# EAGLE design f1control (EAGLE 9.2.0)
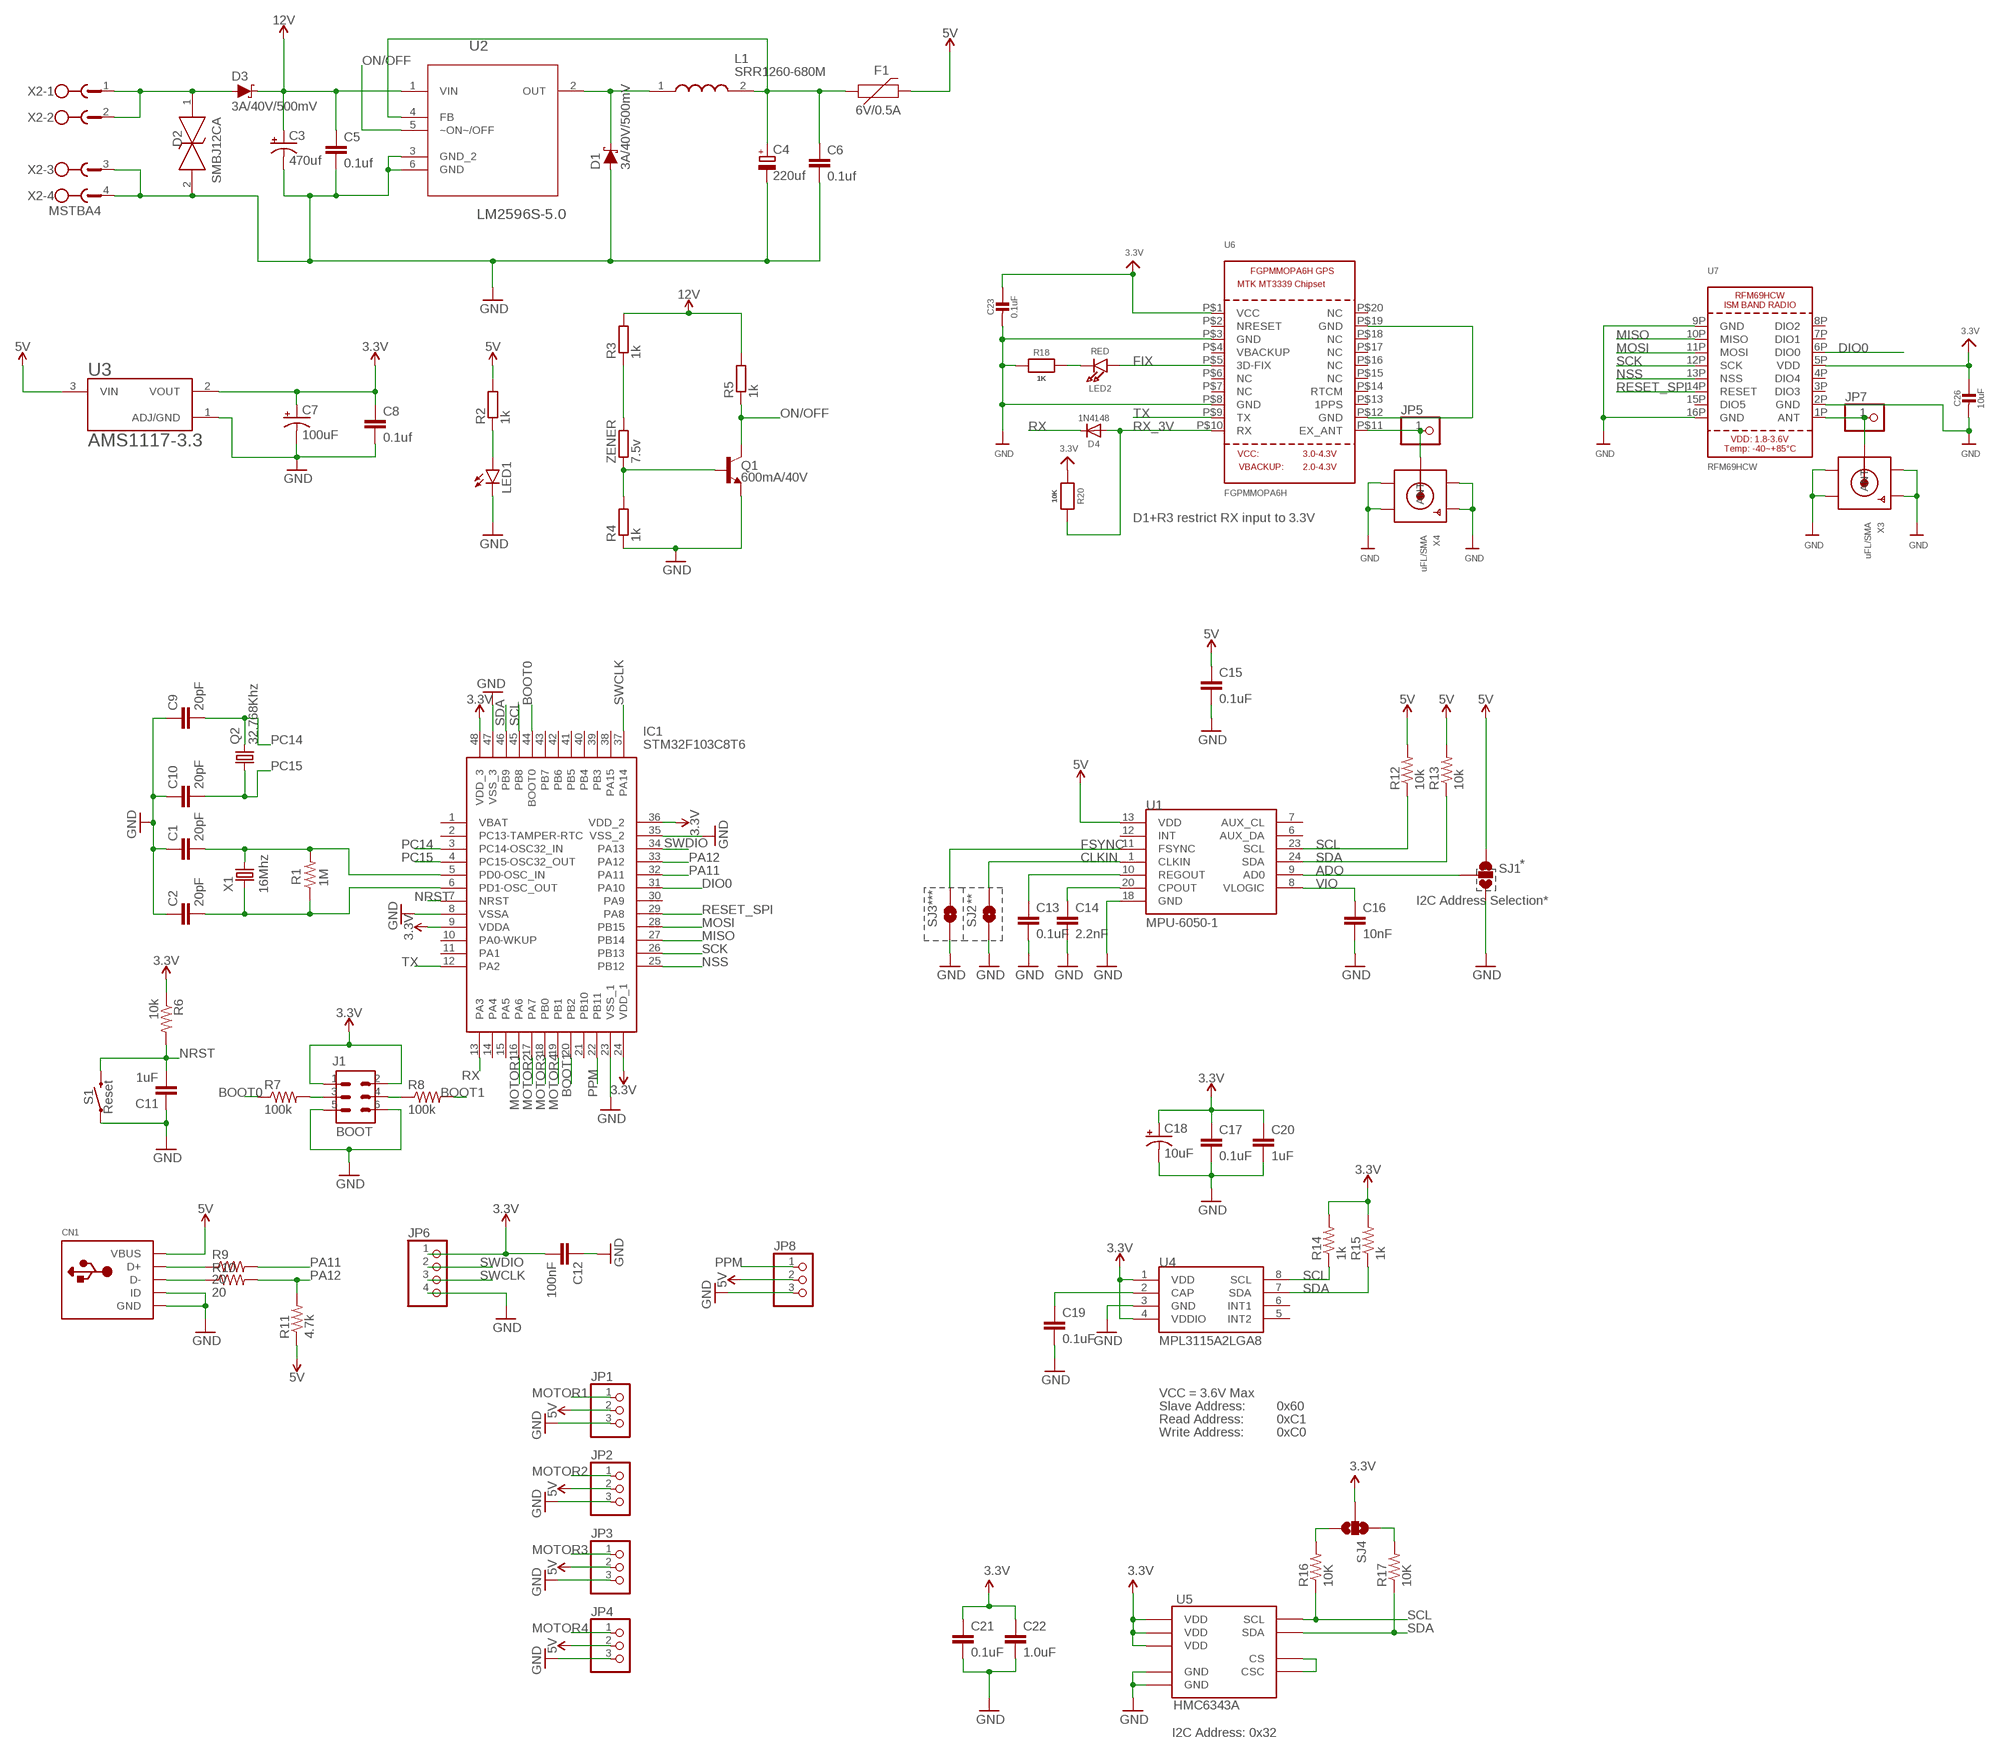
[diagram p0: schematic, sheet 1]

## Parts
C1  20pF  C-EUC0603  [C0603]
C2  20pF  C-EUC0603  [C0603]
C3  470uf  CPOL-USE5-8.5  [E5-8,5]
C4  220uf  CPOL-EU153CLV-1014  [153CLV-1014]
C5  0.1uf  C-EUC0805  [C0805]
C6  0.1uf  C-EUC0805  [C0805]
C7  100uF  100UF-POLAR-10X10.5-63V-20%  [NIC_10X10.5_CAP]
C8  0.1uf  C-EUC0805  [C0805]
C9  20pF  C-EUC0603  [C0603]
C10  20pF  C-EUC0603  [C0603]
C11  1uF  C-EUC0603  [C0603]
C12  100nF  C-EUC0603  [C0603]
C13  0.1uF  CAP0603-CAP  [0603-CAP]
C14  2.2nF  CAP0603-CAP  [0603-CAP]
C15  0.1uF  CAP0603-CAP  [0603-CAP]
C16  10nF  CAP0603-CAP  [0603-CAP]
C17  0.1uF  CAP0402-CAP  [0402-CAP]
C18  10uF  CAP_POL1206  [EIA3216]
C19  0.1uF  CAP0402-CAP  [0402-CAP]
C20  1uF  CAP0402-CAP  [0402-CAP]
C21  0.1uF  0.1UF-25V(+80/-20%)(0603)  [0603-CAP]
C22  1.0uF  1.0UF-16V-10%(0603)  [0603-CAP]
C23  0.1uF  CAP_CERAMIC0805-NOOUTLINE  [0805-NO]
C26  10uF  CAP_CERAMIC0805-NOOUTLINE  [0805-NO]
CN1  USBMINIB  [USB-MINIB]
D1  3A/40V/500mV  DIODE-SCHOTTKY-B340A  [SMA-DIODE]
D2  SMBJ12CA  [DIONM5443X244N]
D3  3A/40V/500mV  DIODE-SCHOTTKY-B340A  [SMA-DIODE]
D4  1N4148  DIODESOD-323  [SOD-323]
F1  6V/0.5A  PPTC_HALF-AMP  [1206]
IC1  STM32F103C8T6  [QFP50P900X900X160-48N]
J1  BOOT  621006245821  [621006245821]
JP1  PINHD-1X3  [1X03]
JP2  PINHD-1X3  [1X03]
JP3  PINHD-1X3  [1X03]
JP4  PINHD-1X3  [1X03]
JP5  HEADER-1X1ROUND  [1X01_ROUND]
JP6  PINHD-1X4  [1X04]
JP7  HEADER-1X1ROUND  [1X01_ROUND]
JP8  PINHD-1X3  [1X03]
L1  SRR1260-680M  [INDPM125125X650N]
LED1  LEDCHIP-LED0805  [CHIP-LED0805]
LED2  RED  LED0805  [CHIPLED_0805]
Q1  600mA/40V  TRANS_NPN-MMBT2222AL  [SOT23-3]
Q2  32.768Khz  MC-306  [MC-306]
R1  1M  R-US_R0603  [R0603]
R2  1k  R-EU_R0805  [R0805]
R3  1k  R-EU_R0805  [R0805]
R4  1k  R-EU_R0805  [R0805]
R5  1k  R-EU_R0805  [R0805]
R6  10k  R-US_R0603  [R0603]
R7  100k  R-US_R0603  [R0603]
R8  100k  R-US_R0603  [R0603]
R9  20  R-US_R0603  [R0603]
R10  20  R-US_R0603  [R0603]
R11  4.7k  R-US_R0603  [R0603]
R12  10k  RESISTOR0603-RES  [0603-RES]
R13  10k  RESISTOR0603-RES  [0603-RES]
R14  1k  RESISTOR0402-RES  [0402-RES]
R15  1k  RESISTOR0402-RES  [0402-RES]
R16  10K  10KOHM1/10W1%(0603)0603  [0603-RES]
R17  10K  10KOHM1/10W1%(0603)0603  [0603-RES]
R18  1K  RESISTOR0805_NOOUTLINE  [0805-NO]
R20  10K  RESISTOR0805_NOOUTLINE  [0805-NO]
S1  Reset  MOMENTARY-SWITCH-SPST-SMD-4.5MM  [TACTILE_SWITCH_SMD_4.5MM]
SJ1  SOLDERJUMPER_2WAYPASTE2&3  [SJ_3_PASTE2&3]
SJ2  SOLDERJUMPERTRACE  [SJ_2S-TRACE]
SJ3  SOLDERJUMPERTRACE  [SJ_2S-TRACE]
SJ4  SOLDERJUMPER_2WAYPASTE1&2&3  [SJ_3_PASTE1&2&3]
U1  MPU-6050-1  [QFN-24-4MM2]
U2  LM2596S-5.0  [TO170P1435X465-6N]
U3  AMS1117-3.3  [SOT229P700X180-4N]
U4  MPL3115A2LGA8  [LGA8]
U5  HMC6343A  [LCC36]
U6  FGPMMOPA6H  GPS_FGPMMOPA6H  [FGPMMOPA6H]
U7  RFM69HCW  RFM69HCW_SMT  [RFMHCW_SMT]
X1  16Mhz  49S/18PF  [XTAL_HC49]
X2  MSTBA4  [MSTBA4]
X3  uFL/SMA  SMACONNECTOR_EDGE_UFL  [SMA_EDGELAUNCH_UFL]
X4  uFL/SMA  SMACONNECTOR_EDGE_UFL  [SMA_EDGELAUNCH_UFL]
ZENER  7.5v  R-EU_0204/7  [0204/7]

## Nets
3.3V: C7.+ C8.1 C12.2 C17.1 C18.A(+) C20.1 C21.1 C22.1 C23.1 C26.1 IC1.9(VDDA) IC1.24(VDD_1) IC1.36(VDD_2) IC1.48(VDD_3) J1.1 J1.2 JP6.1 R6.1 R14.2 R15.2 R20.1 SJ4.2 U3.2(VOUT) U4.1(VDD) U4.4(VDDIO) U5.3(VDD) U5.11(VDD) U5.21(VDD) U6.P$1(VCC) U7.5P(VDD)
5V: C15.1 CN1.VBUS F1.2 JP1.2 JP2.2 JP3.2 JP4.2 JP8.2 R2.2 R11.1 R12.2 R13.2 SJ1.1 U1.13(VDD) U3.3(VIN)
12V: C3.+ C5.1 D3.C R3.2 R5.2 U2.1(VIN)
ADO: SJ1.2 U1.9(AD0)
BOOT0: IC1.44(BOOT0) R7.1
BOOT1: IC1.20(PB2) R8.2
CLKIN: SJ2.2 U1.1(CLKIN)
DIO0: IC1.31(PA10) U7.6P(DIO0)
FIX: LED2.A U6.P$5(3D-FIX)
FSYNC: SJ3.2 U1.11(FSYNC)
GND: C1.1 C2.1 C3.- C4.- C5.2 C6.2 C7.- C8.2 C9.1 C10.1 C11.1 C12.1 C13.2 C14.2 C15.2 C16.2 C17.2 C18.C(-) C19.2 C20.2 C21.2 C22.2 C23.2 C26.2 CN1.GND CN1.ID D1.A D2.2 IC1.8(VSSA) IC1.23(VSS_1) IC1.35(VSS_2) IC1.47(VSS_3) J1.5 J1.6 JP1.3 JP2.3 JP3.3 JP4.3 JP6.4 JP8.3 LED1.C Q1.2(E) R4.1 R18.1 S1.2 S1.3 SJ1.3 SJ2.1 SJ3.1 U1.18(GND) U2.3(GND_2) U2.6(GND) U3.1(ADJ/GND) U4.3(GND) U5.25(GND) U5.29(GND) U6.P$3(GND) U6.P$8(GND) U7.2P(GND) U7.9P(GND) U7.16P(GND) X2.3 X2.4 X3.GND@1(GND1) X3.GND@2(GND2) X3.GND@3(GND3) X3.GND@4(GND4) X4.GND@1(GND1) X4.GND@2(GND2) X4.GND@3(GND3) X4.GND@4(GND4)
MISO: IC1.27(PB14) U7.10P(MISO)
MOSI: IC1.28(PB15) U7.11P(MOSI)
MOTOR1: IC1.16(PA6) JP1.1
MOTOR2: IC1.17(PA7) JP2.1
MOTOR3: IC1.18(PB0) JP3.1
MOTOR4: IC1.19(PB1) JP4.1
N$1: J1.3 R7.2
N$2: C1.2 IC1.5(PD0-OSC_IN) R1.2 X1.2
N$3: C2.2 IC1.6(PD1-OSC_OUT) R1.1 X1.1
N$4: D1.C L1.1 U2.2(OUT)
N$5: LED1.A R2.1
N$6: Q1.1(B) R4.2 ZENER.1
N$7: C4.+ C6.1 F1.1 L1.2 U2.4(FB)
N$8: R3.1 ZENER.2
N$9: D2.1 D3.A X2.1 X2.2
N$10: J1.4 R8.1
N$11: C14.1 U1.20(CPOUT)
N$12: CN1.D+ R9.1
N$13: CN1.D- R10.1
N$14: C13.1 U1.10(REGOUT)
N$15: C19.1 U4.2(CAP)
N$16: U5.22(CS) U5.35(CSC)
N$17: R16.2 SJ4.3
N$18: R17.2 SJ4.1
N$19: LED2.C R18.2
N$20: JP5.1 U6.P$11(EX_ANT) X4.P(ANT)
N$21: JP7.1 U7.1P(ANT) X3.P(ANT)
N$22: U6.P$12(GND) U6.P$19(GND)
NRST: C11.2 IC1.7(NRST) R6.2 S1.1 S1.4
NSS: IC1.25(PB12) U7.13P(NSS)
ON/OFF: Q1.3(C) R5.1 U2.5(~ON~/OFF)
PA11: IC1.32(PA11) R9.2
PA12: IC1.33(PA12) R10.2 R11.2
PC14: C9.2 IC1.3(PC14-OSC32_IN) Q2.4
PC15: C10.2 IC1.4(PC15-OSC32_OUT) Q2.1
PPM: IC1.22(PB11) JP8.1
RESET_SPI: IC1.29(PA8) U7.14P(RESET)
RX: D4.C IC1.13(PA3)
RX_3V: D4.A R20.2 U6.P$10(RX)
SCK: IC1.26(PB13) U7.12P(SCK)
SCL: IC1.45(PB8) R12.1 R14.1 R16.1 U1.23(SCL) U4.8(SCL) U5.32(SCL)
SDA: IC1.46(PB9) R13.1 R15.1 R17.1 U1.24(SDA) U4.7(SDA) U5.36(SDA)
SWCLK: IC1.37(PA14) JP6.3
SWDIO: IC1.34(PA13) JP6.2
TX: IC1.12(PA2) U6.P$9(TX)
VIO: C16.1 U1.8(VLOGIC)
Unconnected: IC1.1(VBAT) IC1.2(PC13-TAMPER-RTC) IC1.10(PA0-WKUP) IC1.11(PA1) IC1.14(PA4) IC1.15(PA5) IC1.21(PB10) IC1.30(PA9) IC1.38(PA15) IC1.39(PB3) IC1.40(PB4) IC1.41(PB5) IC1.42(PB6) IC1.43(PB7) U1.6(AUX_DA) U1.7(AUX_CL) U1.12(INT) U4.5(INT2) U4.6(INT1) U6.P$2(NRESET) U6.P$4(VBACKUP) U6.P$6(NC) U6.P$7(NC) U6.P$13(1PPS) U6.P$14(RTCM) U6.P$15(NC) U6.P$16(NC) U6.P$17(NC) U6.P$18(NC) U6.P$20(NC) U7.3P(DIO3) U7.4P(DIO4) U7.7P(DIO1) U7.8P(DIO2) U7.15P(DIO5)

## Notes on the sheet
- D1+R3 restrict RX input to 3.3V
- *
- *** | ** | I2C Address Selection*
- VCC = 3.6V Max
- Slave Address: | 0x60
- Read Address: | 0xC1
- Write Address: | 0xC0
- I2C Address: 0x32

## Library data of the parts
C1 C2 C5 C6 C8-C12 = rcl:C-EU: CAPACITOR, European symbol; SPICEPREFIX: C
C3 = adafruit:CPOL-US: POLARIZED CAPACITOR, American symbol
C4 = rcl:CPOL-EU: POLARIZED CAPACITOR, European symbol; SPICEPREFIX: C
C7 = SparkFun-Capacitors:100UF-POLAR: 100µF polarized capacitors A capacitor is a passive two-terminal electrical component used to store electrical energy temporarily in an electric field.; PROD_ID: CAP-08362
C13-C17 C19 C20 = SparkFun:CAP: Capacitor Standard 0603 ceramic capacitor, and 0.1" leaded capacitor.
C18 = SparkFun:CAP_POL: Capacitor Polarized These are standard SMD and PTH capacitors. Normally 10uF, 47uF, and 100uF in electrolytic and tantalum varieties. Always verify the external diameter of the through hole cap, it varies with capacity, voltage, and manufacturer. The EIA devices should be standard.
C21 = SparkFun-Capacitors:0.1UF-25V(+80/-20%)(0603): CAP-00810 Ceramic Standard decoupling cap; PROD_ID: CAP-00810
C22 = SparkFun-Capacitors:1.0UF-16V-10%(0603): CAP-00868; PROD_ID: CAP-00868
C23 C26 = microbuilder:CAP_CERAMIC: Ceramic Capacitors For new designs, use the packages preceded by an '_' character since they are more reliable: The following footprints should be used on most boards: _0402 - Standard footprint for regular board layouts _0603 - Standard footprint for regular board layouts _0805 - Standard footprint for regular board layouts _1206 - Standard footprint for regular board layouts For extremely tight-pitch boards where space is at a premium, the following 'micro-pitch' footprints can be used (smaller pads, no silkscreen outline, etc.): _0402MP - Micro-pitch footprint for very dense/compact boards _0603MP - Micro-pitch footprint for very dense/compact boards _0805MP - Micro-pitch footprint for very dense/compact boards _1206MP - Micro-pitch footprint for very dense/compact boards
CN1 = adafruit:USB: USB Connectors USBMINIB - Surface Mount Female Mini-B USB Connector 4UConnector: 06564 By microbuilder.eu Thru-hole RA Female Mini-B USB Connector 4UConnector: 18732 By ladyada.net
D1 D3 = SparkFun-DiscreteSemi:DIODE-SCHOTTKY: Schottky diode A Schottky diode is a semiconductor diode which has a low forward voltage drop and a very fast switching action.; PROD_ID: DIO-09886
D2 = SMBJ12CA:SMBJ12CA: BOURNS - SMBJ12CA - TVS DIODE, 600W, 12V, BIDIR, DO-214AA Source: Datasheet <https://www.mouser.com/ds/2/54/mbj-778392.pdf>; DESCRIPTION: BOURNS - SMBJ12CA - TVS DIODE, 600W, 12V, BIDIR, DO-214AA; HEIGHT: 2.44mm; MANUFACTURER_NAME: Bourns; MANUFACTURER_PART_NUMBER: SMBJ12CA; MOUSER_PART_NUMBER: 652-SMBJ12CA; MOUSER_PRICE-STOCK: https://www.mouser.com/Search/Refine.aspx?Keyword=652-SMBJ12CA
D4 = microbuilder:DIODE: Diode SMA Model Volts Amps Type Vf Ir Digikey # Notes SSA34-E3 40V 3A Schottky 480mV @ 3A 200uA @ 40V SSA34-E3/61TGITR-ND CDBA120-G 20V 1A Schottky 500mV @ 1A 500uA @ 20V 641-1014-6-ND REEL MBRA210 10V 2A Schottky 350mV @ 2A 700uA @ 10V MBRA210LT3 SOD-123 Model Volts Amps Type Vf Ir Order # Notes BAT54T1G 30V 200mA Schottky 800mV @ 200mA 2uA @ 25V BAT54T1GOSTR-ND B0530W 30V 500mA Schottky 430mV @ 500mA 130uA @ 30V B0530W-FDICT-ND REEL MBR120 20V 1A Schottky 340mV @ 1A MBR120VLSFT1GOSCT-ND SOD-323 Model Volts Amps Type Vf Ir Order # Notes PMEG2005EJ 20V 500mA Schottky 355mV @ 500mA 568-4110-1-ND ZLLS410 10V 570mA Schottky 380mV @ 570mA ZLLS410CT-ND 1N4148WS 75V 150mA Silicon/Simple 1V 1N4148WSFSCT-ND REEL SOD-523 Model Volts Amps Type Vf Ir Order # Notes BAT54XV2 30V 200mA Schottky 0.8V @ 100mA BAT54XV2CT-ND TB751S 30V 30mA Schottky RB751S-40TE61CT-ND SOT23-R/W (R = Solder Paste/Reflow Ovens, W = Hand-Soldering) Model Volts Amps Type Vf Ir Order # Notes BAT54FILM 40V 300mA Schottky 497-7162-1-ND POWERDI-5 Model Volts Amps Type Vf Ir Order # Notes PDS560 60V 5A Schottky 670mV @ 5A 150uA @ 60V PDS560DICT-ND
F1 = SparkFun-Fuses:PPTC: Resettable Fuse PPTC Resettable Fuse. Really a sort of resistor with a polymeric positive temperature coefficient whose resistance increases dramatically with an increase in temperature. When heated by the power passing through the resistance rises causing the current to be limited, protecting the circuit. This is achieved by the transition of the polymer from a crystalline to an amorphous state where the conductive carbon separates breaking the conductive pathways found in the cool crystalline structure. When a PPTC cools back down it resumes conducting letting the circuit turn back on. SparkFun Products: SparkFun RedBoard - Programmed with Arduino <https://www.sparkfun.com/products/12757> Pro Micro - 5V/16MHz <https://www.sparkfun.com/products/12640> Arduino Pro 328 - 5V/16MHz <https://www.sparkfun.com/products/10915> MP3 Trigger <https://www.sparkfun.com/products/13720>; PROD_ID: RES-08585
IC1 = STM32F103C8T6:STM32F103C8T6: STM32F103C8T6, 32 bit ARM Cortex M3 Microcontroller 72MHz 64kb Flash, 20kb RAM, USB I2C SPI 48-Pin LQFP Source: Datasheet <http://www.st.com/st-web-ui/static/active/en/resource/technical/document/datasheet/CD00161566.pdf>; ALLIED_NUMBER: 70390993; ALLIED_PRICE-STOCK: http://www.alliedelec.com/stmicroelectronics-stm32f103c8t6/70390993/; DESCRIPTION: STM32F103C8T6, 32 bit ARM Cortex M3 Microcontroller 72MHz 64kb Flash, 20kb RAM, USB I2C SPI 48-Pin LQFP; HEIGHT: 1.6mm; MANUFACTURER_NAME: STMicroelectronics; MANUFACTURER_PART_NUMBER: STM32F103C8T6; MOUSER_PART_NUMBER: 511-STM32F103C8T6; MOUSER_PRICE-STOCK: https://www.mouser.com/Search/Refine.aspx?Keyword=511-STM32F103C8T6; RS_PART_NUMBER: 0402279P; RS_PRICE-STOCK: http://uk.rs-online.com/web/p/products/0402279P
J1 = Headers:621006245821: 2.00mm SMT Straight Dual Low Profile Pin Header WR-PHD Manufacturer's datasheet <https://katalog.we-online.com/em/datasheet/621006245821.pdf>; CREATED_BY: PCBLayout.com; MANUFACTURER: Wurth Elektronik; MPN: 621006245821
JP1-JP4 JP8 = pinhead:PINHD-1X3: PIN HEADER
JP5 JP7 = microbuilder:HEADER-1X1: PIN HEADER
JP6 = pinhead:PINHD-1X4: PIN HEADER
L1 = SRR1260-680M:SRR1260-680M: Power inductor SMD shielded 68uH 2.1A Bourns SRR1260 Series Shielded Wire-wound SMD Inductor with a Ferrite Core, 68 uH +/-20% 2.1A Idc Q:22 Source: Datasheet <https://componentsearchengine.com/Datasheets/2/SRR1260-680M.pdf>; ALLIED_NUMBER: 70277070; ALLIED_PRICE-STOCK: https://www.alliedelec.com/bourns-srr1260-680m/70277070/; DESCRIPTION: Power inductor SMD shielded 68uH 2.1A Bourns SRR1260 Series Shielded Wire-wound SMD Inductor with a Ferrite Core, 68 uH +/-20% 2.1A Idc Q:22; HEIGHT: 6.5mm; MANUFACTURER_NAME: Bourns; MANUFACTURER_PART_NUMBER: SRR1260-680M; MOUSER_PART_NUMBER: 652-SRR1260-680M; MOUSER_PRICE-STOCK: https://www.mouser.com/Search/Refine.aspx?Keyword=652-SRR1260-680M; RS_PART_NUMBER: 7272243P; RS_PRICE-STOCK: http://uk.rs-online.com/web/p/products/7272243P
LED1 = led:LED: LED
LED2 = microbuilder:LED: LED
Q1 = SparkFun-DiscreteSemi:TRANS_NPN: NPN transistor Current controlled devices typically used to amplify current or used as a switch. BC547 - COM-08928 <http://www.sparkfun.com/products/8928> (TO-92 45V 100mA) (1.Collector 2.Base 3.Emitter) 2N3904 - COM-00521 <http://www.sparkfun.com/products/521> (TO-92 40V 200mA) (1.Emitter 2.Base 3.Collector) P2N2222A - COM-12852 <http://www.sparkfun.com/products/12852> (TO-92 40V 600mA) (1.Collector 2.Base 3.Emitter); PROD_ID: TRANS-08049
Q2 = crystal:MC-306: kHz RANGE CRYSTAL UNIT SMD Source: MC-306_405_406_E07X.PDF Homepage <http://www.epsontoyocom.co.jp>; MPN: MC-306 60.0KHZ 100PPM ,12.5PF; OC_FARNELL: 1278040; OC_NEWARK: 31M5576
R1 R6-R11 = adafruit:R-US_: RESISTOR, American symbol
R2-R5 ZENER = rcl:R-EU_: RESISTOR, European symbol; SPICEPREFIX: R
R12-R15 = SparkFun:RESISTOR: Resistor Basic schematic elements and footprints for 0603, 1206, and PTH resistors.
R16 R17 = SparkFun-Resistors:10KOHM1/10W1%(0603): RES-00824; PROD_ID: RES-00824
R18 R20 = microbuilder:RESISTOR: Resistors For new designs, use the packages preceded by an '_' character since they are more reliable: The following footprints should be used on most boards: _0402 - Standard footprint for regular board layouts _0603 - Standard footprint for regular board layouts _0805 - Standard footprint for regular board layouts _1206 - Standard footprint for regular board layouts For extremely tight-pitch boards where space is at a premium, the following 'micro-pitch' footprints can be used (smaller pads, no silkscreen outline, etc.): _0402MP - Micro-pitch footprint for very dense/compact boards _0603MP - Micro-pitch footprint for very dense/compact boards _0805MP - Micro-pitch footprint for very dense/compact boards _1206MP - Micro-pitch footprint for very dense/compact boards
S1 = SparkFun-Switches:MOMENTARY-SWITCH-SPST: Momentary Switch (Pushbutton) - SPST Normally-open (NO) SPST momentary switches (buttons, pushbuttons). Variants PTH-12MM - 12mm square, through-hole Momentary Pushbutton Switch - 12mm Square <https://www.sparkfun.com/products/9190> (COM-09190) PTH-6.0MM, PTH-6.0MM-KIT - 6.0mm square, through-hole Mini Pushbutton Switch <https://www.sparkfun.com/products/97> (COM-00097) KIT package intended for soldering kit's - only one side of pads' copper is exposed. PTH-RIGHT-ANGLE-KIT - Right-angle, through-hole Right Angle Tactile Button <https://www.sparkfun.com/products/10791> - Used on SparkFun BigTime Watch Kit <https://www.sparkfun.com/products/11734> SMD-12MM - 12mm square, surface-mount Tactile Button - SMD (12mm) <https://www.sparkfun.com/products/12993> (COM-12993) Used on SparkFun PicoBoard <https://www.sparkfun.com/products/11888> SMD-4.5MM - 4.5mm Square Trackball Switch Used on SparkFun Blackberry Trackballer Breakout <https://www.sparkfun.com/products/13169> SMD-4.6MMX2.8MM - 4.60mm x 2.80mm, surface mount Used on SparkFun SAMD21 Mini Breakout <https://www.sparkfun.com/products/13664> SMD-5.2MM, SMD-5.2-REDUNDANT - 5.2mm square, surface-mount Mini Pushbutton Switch - SMD <https://www.sparkfun.com/products/8720> (COM-08720) Used on Arduino Pro Mini <https://www.sparkfun.com/products/11114> REDUNDANT package connects both switch circuits together SMD-6.0X3.5MM - 6.0 x 3.5mm, surface mount Momentary Reset Switch SMD <https://www.sparkfun.com/products/8229> (COM-08229) SMD-6.2MM-TALL - 6.2mm square, surface mount Tactile Button - SMD (6mm) <https://www.sparkfun.com/products/12992> Used on SparkFun Digital Sandbox <https://www.sparkfun.com/products/12651> SMD-RIGHT-ANGLE - Right-angle, surface mount Used on SparkFun Block for Intel® Edison - Arduino <https://www.sparkfun.com/products/13036>; PROD_ID: SWCH-09213
SJ1 = SparkFun:SOLDERJUMPER_2WAY: Solder Jumper 2 way solder jumper
SJ2 SJ3 = SparkFun:SOLDERJUMPER: Solder Jumper Standard SMD solder jumper. Used to automate production. Two varients : Normally Open and Normally Closed are the same, but have different paste layers. NC will have a large amount of paste and should jumper during reflow.
SJ4 = SparkFun-Passives:SOLDERJUMPER_2WAY: Solder Jumper 2 way solder jumper
U1 = Testing:MPU-6050
U2 = LM2596S-5.0:LM2596S-5.0: Step-Down Voltage Regulator; AVAILABILITY: Unavailable; MF: Texas; MP: LM2596S-5.0; PACKAGE: TO-263-6 NEC; PRICE: None
U3 = AMS1117-3.3:AMS1117-3.3: Sot223/Pkg 1-Amp 3.3-Volt Low Drop Out Voltage Regulatator; AVAILABILITY: Unavailable; DESCRIPTION: Sot223/Pkg 1-Amp 3.3-Volt Low Drop Out Voltage Regulatator; MF: Advanced Monolithic Systems; MP: AMS1117-3.3; PACKAGE: None; PRICE: None
U4 = SparkFun-Sensors:MPL3115A2: Altimeter/Pressure Sensor, I2C, 1.95V-3.6V supply, 50 to 110kPa
U5 = SparkFun-Sensors:HMC6343: Honeywell compass IC with tilt compensation, SEN-08656
U6 = microbuilder:GPS_FGPMMOPA6H: GPS Module - MTK MT3339 Chipset, -165dBm sensitivity, 22 channels, 10Hz, auto-select external antenna options
U7 = microbuilder:RFM69HCW: RFM69HCW - ISM Band RF Transceiver
X1 = Crystals:49S/18PF: Crystal Manufacturer's datasheet <https://datasheet.octopart.com/49S-18PF-Xinhunjing-datasheet-30677139.pdf>; CREATED_BY: PCBLayout.com; MANUFACTURER: Xinhunjing; MPN: 49S/18PF; PACKAGE: SMD
X2 = con-phoenix-508:MSTBA4: PHOENIX; MF: FARNELL; MPN: 1757268; OC_FARNELL: 3705195; OC_NEWARK: 71C4163
X3 X4 = microbuilder:SMACONNECTOR: SMA Connector 90° DIP SMA Connector, 50 Ohm (4UConnector: 07259)

## Board
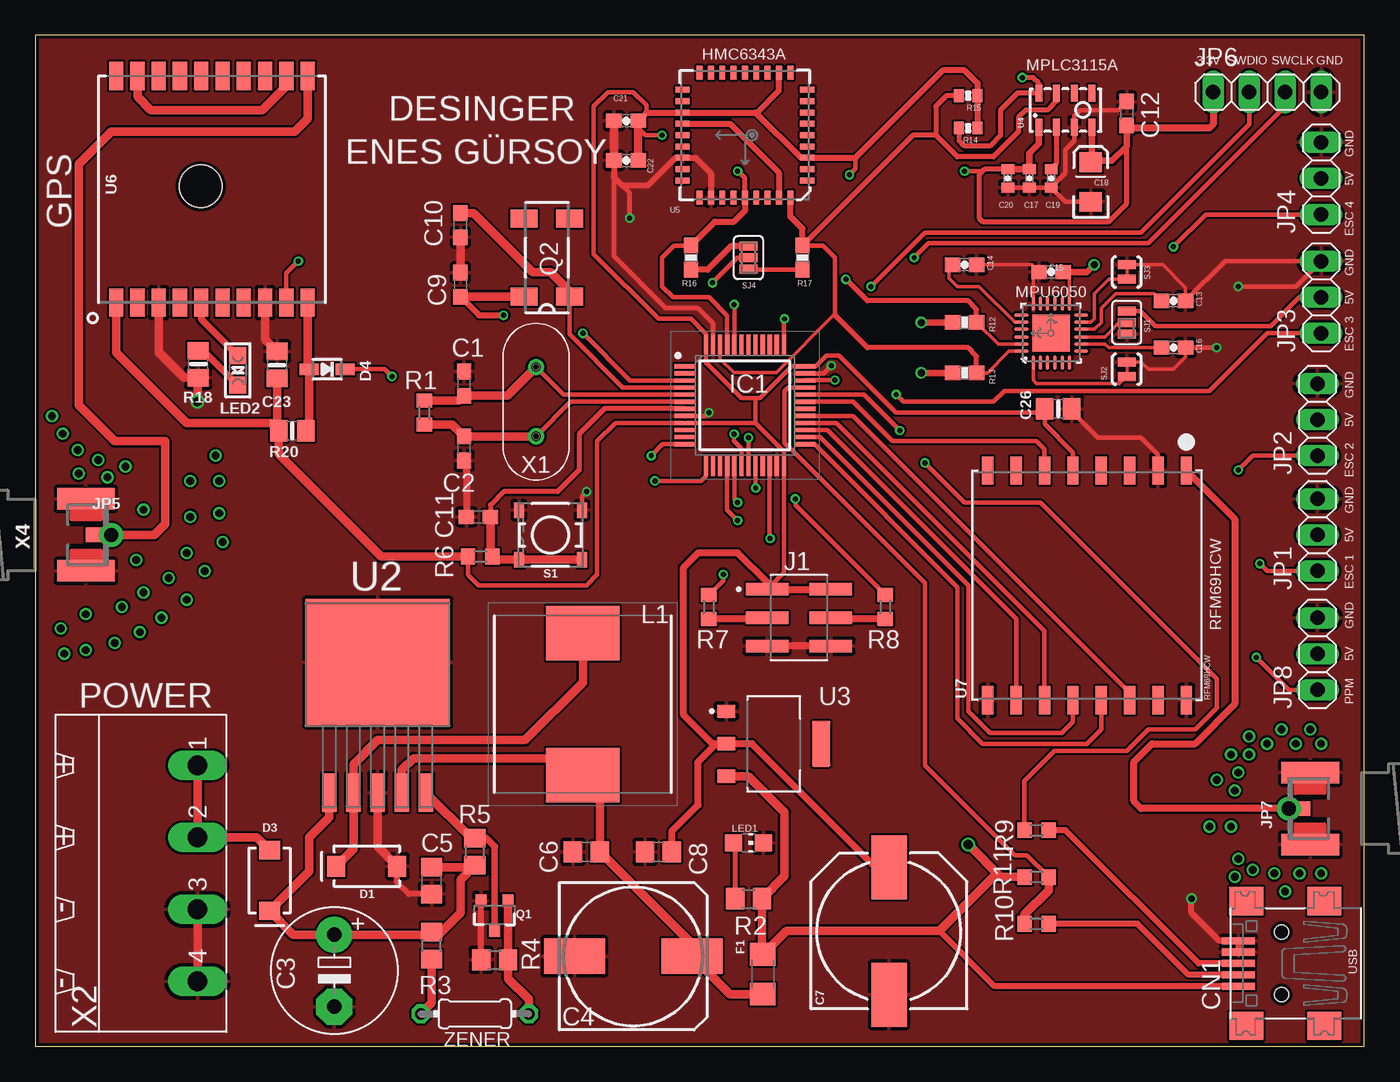
[diagram p1: board, top side]
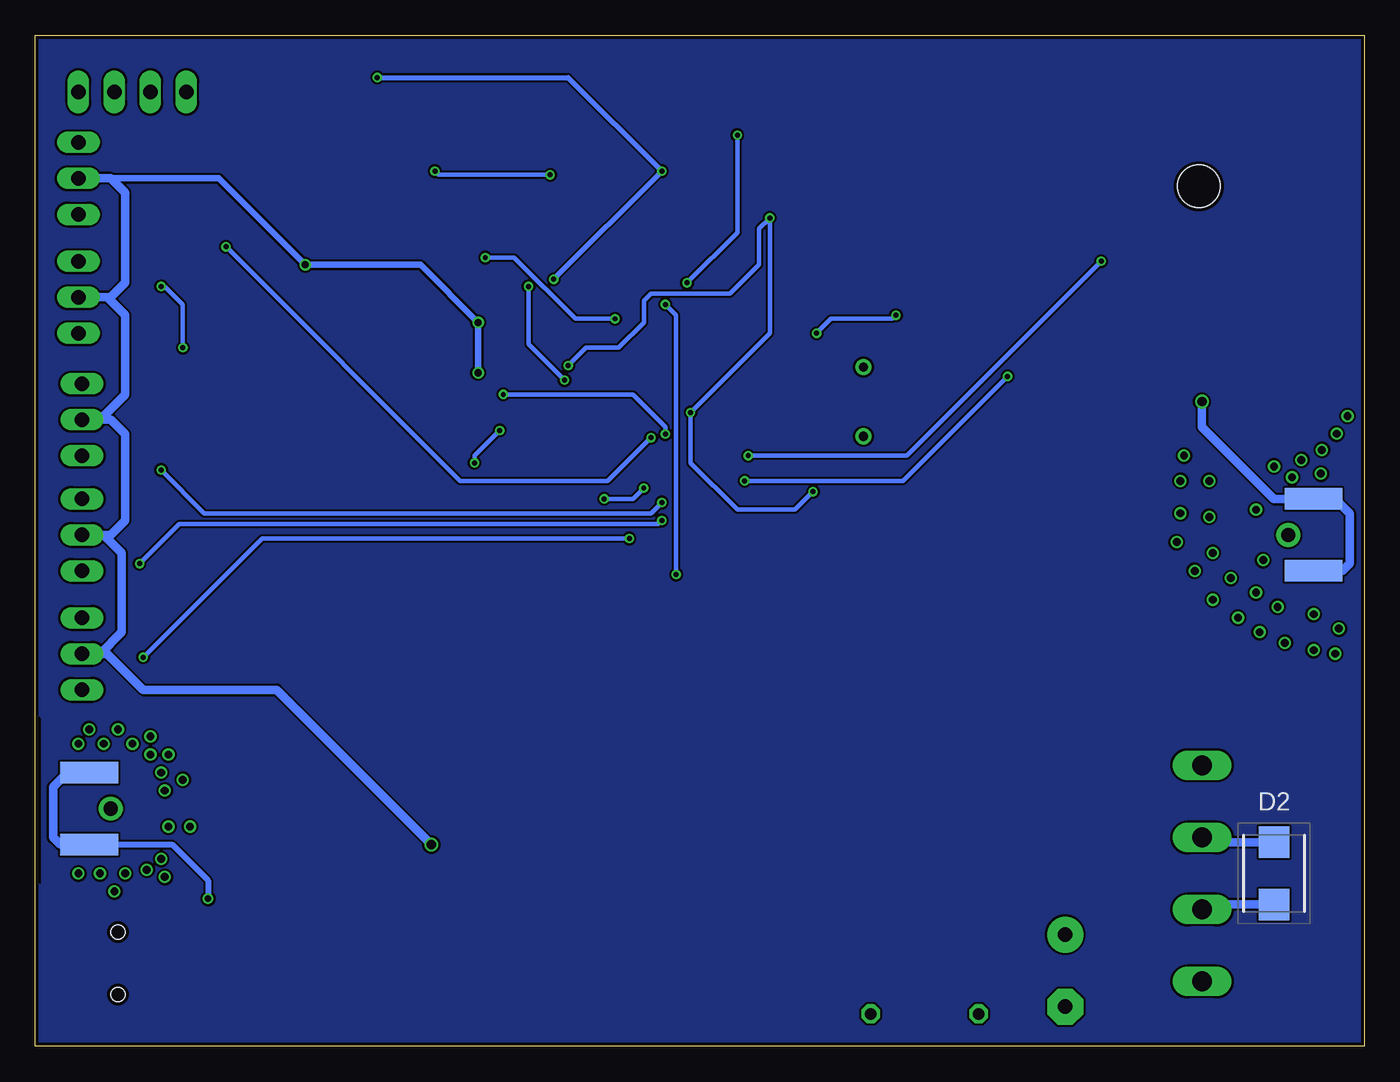
[diagram p2: board, bottom side, seen from below]

Size 93.71 x 71.3 mm. Coordinates in mm from the lower left corner, seen from the top.
Outline: 0,0 93.71,0 93.71,71.3 0,71.3 0,0
Copper layers (1*16): Top 0.035mm / dielectric 1.5mm / Bottom 0.035mm
Design rules "SeeedStudio_2layer_DRU_no_angle_20140221": minimum track width 6mil, minimum drill 12mil, track to track 6mil, track to pad 6mil, pad to pad 6mil, via to via 6mil, smd to smd 0mil, copper to edge 10mil, drill to drill 10mil, minimum pad ring 10mil, minimum via ring 6mil, stop-mask expansion 2mil, vias tented up to drill 100mil, thermal gap 10mil

### Footprints (pad centres in the part's own frame; a part is rotated, then mirrored left to right if it is on the bottom)
C0603 = smd 1.1 x 1: 1 -0.85,0; 2 0.85,0
E5-8,5 = drill 1.016 pad 2.54: + -2.54,0 | drill 1.016 pad 2.54 octagon: - 2.54,0
153CLV-1014 = smd 4.3 x 2.5: + 4.15,0; - -4.15,0
C0805 = smd 1.3 x 1.5: 1 -0.95,0; 2 0.95,0
NIC_10X10.5_CAP = smd 4.5 x 2.5: + 4.5,0; - -4.5,0
0603-CAP = smd 1.1 x 1: 1 -0.85,0; 2 0.85,0
0402-CAP = smd 0.7 x 0.9: 1 -0.65,0; 2 0.65,0
EIA3216 = smd 1.4 x 1.6: A 1.4,0; C -1.4,0
0805-NO = smd 1.24 x 1.5: 1 -0.95,0; 2 0.95,0
USB-MINIB = smd 0.5 x 2.308: D+ 0,4.064; D- -0.8,4.064; GND 1.6,4.064; ID 0.8,4.064; VBUS -1.6,4.064 | smd 2 x 2.4: GND1 -4.4,-2; GND2 -4.4,3.5; GND3 4.4,3.5; GND4 4.4,-2 | hole 1: -2.2,1; 2.2,1
SMA-DIODE = smd 1.27 x 1.47: A -2.15,0; C 2.15,0
DIONM5443X244N = smd 2.2 x 2.15: 1 -2.2,0; 2 2.2,0
SOD-323 = smd 1.35 x 0.8: A 1.27,0; C -1.27,0
1206 = smd 1.6 x 1.8: 1 -1.4,0; 2 1.4,0
QFP50P900X900X160-48N = smd 1.475 x 0.3: 1 -4.238,2.75; 2 -4.238,2.25; 3 -4.238,1.75; 4 -4.238,1.25; 5 -4.238,0.75; 6 -4.238,0.25; 7 -4.238,-0.25; 8 -4.238,-0.75; 9 -4.238,-1.25; 10 -4.238,-1.75; 11 -4.238,-2.25; 12 -4.238,-2.75; 25 4.238,-2.75; 26 4.238,-2.25; 27 4.238,-1.75; 28 4.238,-1.25; 29 4.238,-0.75; 30 4.238,-0.25; 31 4.238,0.25; 32 4.238,0.75; 33 4.238,1.25; 34 4.238,1.75; 35 4.238,2.25; 36 4.238,2.75 | smd 0.3 x 1.475: 13 -2.75,-4.238; 14 -2.25,-4.238; 15 -1.75,-4.238; 16 -1.25,-4.238; 17 -0.75,-4.238; 18 -0.25,-4.238; 19 0.25,-4.238; 20 0.75,-4.238; 21 1.25,-4.238; 22 1.75,-4.238; 23 2.25,-4.238; 24 2.75,-4.238; 37 2.75,4.238; 38 2.25,4.238; 39 1.75,4.238; 40 1.25,4.238; 41 0.75,4.238; 42 0.25,4.238; 43 -0.25,4.238; 44 -0.75,4.238; 45 -1.25,4.238; 46 -1.75,4.238; 47 -2.25,4.238; 48 -2.75,4.238
621006245821 = smd 0.89 x 3: 1 -2,-2.25; 2 -2,2.25; 3 0,-2.25; 4 0,2.25; 5 2,-2.25; 6 2,2.25
1X03 = drill 1.016 long: 1 -2.54,0; 2 0,0; 3 2.54,0
1X01_ROUND = drill 1 pad 1.676: 1 0,0
1X04 = drill 1.016 long: 1 -3.81,0; 2 -1.27,0; 3 1.27,0; 4 3.81,0
INDPM125125X650N = smd 3.85 x 5.2: 1 -5,0; 2 5,0
CHIP-LED0805 = smd 1.2 x 1.2: A 0,-1.05; C 0,1.05
CHIPLED_0805 = smd 1.2 x 1.2: A 0,-1.05; C 0,1.05
SOT23-3 = smd 0.8 x 0.9: 1 -0.95,-1; 2 0.95,-1; 3 0,1.1
MC-306 = smd 1.3 x 1.9: 1 -2.75,-1.6; 2 2.75,-1.6; 3 2.75,1.6; 4 -2.75,1.6
R0603 = smd 1 x 1.1: 1 -0.85,0; 2 0.85,0
R0805 = smd 1.3 x 1.5: 1 -0.95,0; 2 0.95,0
0603-RES = smd 1.1 x 1: 1 -0.85,0; 2 0.85,0
0402-RES = smd 0.7 x 0.9: 1 -0.65,0; 2 0.65,0
TACTILE_SWITCH_SMD_4.5MM = smd 0.7 x 1.1: 1 2.225,1.75; 2 2.225,-1.75; 3 -2.225,-1.75; 4 -2.225,1.75
SJ_3_PASTE2&3 = smd 0.635 x 1.27: 1 -0.813,0; 2 0,0; 3 0.813,0
SJ_2S-TRACE = smd 0.635 x 1.27: 1 -0.508,0; 2 0.508,0
SJ_3_PASTE1&2&3 = smd 0.635 x 1.27: 1 -0.813,0; 2 0,0; 3 0.813,0
QFN-24-4MM2 = smd 1.016 x 0.254: 1 -2.066,1.257; 2 -2.066,0.75; 3 -2.066,0.247; 4 -2.066,-0.287; 5 -2.066,-0.792; 6 -2.066,-1.297; 13 2.086,-1.297; 14 2.086,-0.792; 15 2.086,-0.287; 16 2.086,0.247; 17 2.086,0.75; 18 2.086,1.257 | smd 0.254 x 1.016: 7 -1.267,-2.122; 8 -0.762,-2.122; 9 -0.258,-2.122; 10 0.278,-2.122; 11 0.78,-2.122; 12 1.287,-2.122; 19 1.287,2.082; 20 0.78,2.082; 21 0.278,2.082; 22 -0.258,2.082; 23 -0.762,2.082; 24 -1.267,2.082 | smd 2.616 x 2.616: P$1 0.02,-0.01
TO170P1435X465-6N = smd 1.016 x 2.692: 1 -3.404,-9.042; 2 -1.702,-9.042; 3 0,-9.042; 4 1.702,-9.042; 5 3.404,-9.042 | smd 10.16 x 8.941: 6 0,0.152
SOT229P700X180-4N = smd 0.93 x 1.31: 1 -2.29,-3.345; 2 0,-3.345; 3 2.29,-3.345 | smd 3.24 x 1.31: 4 0,3.345
LGA8 = smd 1.2 x 0.5: 1 -1.2,1.875; 2 -1.2,0.625; 3 -1.2,-0.625; 4 -1.2,-1.875; 5 1.2,-1.875; 6 1.2,-0.625; 7 1.2,0.625; 8 1.2,1.875
LCC36 = smd 1 x 0.42: 1 -4.4,3.2; 2 -4.4,2.4; 3 -4.4,1.6; 4 -4.4,0.8; 5 -4.4,0; 6 -4.4,-0.8; 7 -4.4,-1.6; 8 -4.4,-2.4; 9 -4.4,-3.2; 19 4.4,-3.2; 20 4.4,-2.4; 21 4.4,-1.6; 22 4.4,-0.8; 23 4.4,0; 24 4.4,0.8; 25 4.4,1.6; 26 4.4,2.4; 27 4.4,3.2 | smd 0.42 x 1: 10 -3.2,-4.4; 11 -2.4,-4.4; 12 -1.6,-4.4; 13 -0.8,-4.4; 14 0,-4.4; 15 0.8,-4.4; 16 1.6,-4.4; 17 2.4,-4.4; 18 3.2,-4.4; 28 3.2,4.4; 29 2.4,4.4; 30 1.6,4.4; 31 0.8,4.4; 32 0,4.4; 33 -0.8,4.4; 34 -1.6,4.4; 35 -2.4,4.4; 36 -3.2,4.4
FGPMMOPA6H = smd 2 x 1: P$1 -8,6.75; P$2 -8,5.25; P$3 -8,3.75; P$4 -8,2.25; P$5 -8,0.75; P$6 -8,-0.75; P$7 -8,-2.25; P$8 -8,-3.75; P$9 -8,-5.25; P$10 -8,-6.75; P$11 8,-6.75; P$12 8,-5.25; P$13 8,-3.75; P$14 8,-2.25; P$15 8,-0.75; P$16 8,0.75; P$17 8,2.25; P$18 8,3.75; P$19 8,5.25; P$20 8,6.75 | hole 3: 0.2,0.8
RFMHCW_SMT = smd 2 x 0.8: 1P 8.1,-7; 2P 8.1,-5; 3P 8.1,-3; 4P 8.1,-1; 5P 8.1,1; 6P 8.1,3; 7P 8.1,5; 8P 8.1,7; 9P -8.1,7; 10P -8.1,5; 11P -8.1,3; 12P -8.1,1; 13P -8.1,-1; 14P -8.1,-3; 15P -8.1,-5; 16P -8.1,-7
XTAL_HC49 = drill 0.65 pad 1.05: 1 -2.44,0; 2 2.44,0
MSTBA4 = drill 1.397 long: 1 -7.62,5.08; 2 -2.54,5.08; 3 2.54,5.08; 4 7.62,5.08
SMA_EDGELAUNCH_UFL = smd 4.064 x 1.524: GND@1 2.032,-2.54; GND@2 2.032,2.54 | smd 4.064 x 1.524 bottom: GND@3 2.032,2.54; GND@4 2.032,-2.54 | smd 2.032 x 1.016: P 3.048,0
0204/7 = drill 0.813 octagon: 1 -3.81,0; 2 3.81,0

### Placement (x,y rotation side)
C1  30.23,46.74 270 top
C2  30.23,42.16 90 top
C3  21.08,5.33 270 top
C4  42.16,6.35 0 top
C5  27.94,11.68 270 top
C6  38.86,13.72 180 top
C7  60.2,8.13 90 top
C8  43.94,13.72 180 top
C9  29.97,53.72 270 top
C10  29.97,57.91 90 top
C11  31.24,37.34 0 top
C12  76.96,65.79 270 top
C13  80.26,52.58 0 top
C14  65.53,55.12 0 top
C15  71.63,54.61 180 top
C16  80.26,49.28 0 top
C17  70.1,61.21 270 top
C18  74.42,60.96 90 top
C19  71.63,61.21 270 top
C20  68.58,61.21 270 top
C21  41.66,65.28 180 top
C22  41.66,62.48 180 top
C23  17.04,48.06 90 top
C26  72.14,44.96 0 top
CN1  88.9,5.84 90 top
D1  23.37,12.7 180 top
D2  6.35,12.19 270 bottom
D3  16.51,11.68 270 top
D4  20.57,47.75 180 top
F1  51.31,5.08 90 top
IC1  50.04,45.21 0 top
J1  53.85,30.23 270 top
JP1  90.42,36.07 90 top
JP2  90.42,44.2 90 top
JP3  90.68,52.83 90 top
JP4  90.68,61.21 90 top
JP5  5.33,36.07 0 top
JP6  86.87,67.31 0 top
JP7  88.39,16.76 270 top
JP8  90.42,27.69 90 top
L1  38.61,24.13 270 top
LED1  50.29,14.35 270 top
LED2  14.27,47.68 180 top
Q1  32.38,9.27 180 top
Q2  36.07,55.63 90 top
R1  27.43,44.7 90 top
R2  50.29,10.41 0 top
R3  27.94,7.11 90 top
R4  32.38,6.1 0 top
R5  30.99,13.72 270 top
R6  31.37,34.54 0 top
R7  47.5,30.99 270 top
R8  59.94,30.99 90 top
R9  70.61,15.24 180 top
R10  70.61,8.64 180 top
R11  70.61,11.94 0 top
R12  65.53,51.05 180 top
R13  65.53,47.5 180 top
R14  65.79,64.77 0 top
R15  65.79,67.06 0 top
R16  46.23,55.63 270 top
R17  54.1,55.63 270 top
R18  11.48,48.11 90 top
R20  18.11,43.41 0 top
S1  36.32,36.07 180 top
SJ1  76.96,51.05 270 top
SJ2  76.96,47.75 270 top
SJ3  76.96,54.61 270 top
SJ4  50.29,55.63 90 top
U1  71.63,50.29 90 top
U2  24.13,26.92 0 top
U3  52.07,21.34 270 top
U4  72.64,66.04 90 top
U5  50.04,64.26 180 top
U6  12.45,60.45 90 top
U7  74.17,32.51 90 top
X1  35.31,45.47 90 top
X2  6.35,12.19 270 top
X3  91.95,16.76 180 top
X4  1.52,36.07 0 top
ZENER  30.99,2.29 180 top

### Tracks (layer width: path | path; a pad name or v marks a point on that pad's centre or on a via)
3.3V  (via drill 0.35)
  Top 0.305: U7.5P 73.17,41.89 71.19,43.88 71.19,44.7 | 71.19,44.7 C26.1 | J1.1 52.79,33.42 IC1.24 52.79,41.95 50.78,43.96 | 50.78,43.96 IC1.9 40.92,43.97 39.62,42.67 39.62,33.27 38.86,32.51 31.24,32.51 30.52,33.23 R6.1 | 50.78,45.72 50.78,43.96 | 50.78,45.72 49.78,45.72 47.29,48.22 IC1.48 47.29,50.25 46.23,51.31 43.94,51.31 39.37,55.88 39.37,66.29 40.39,67.31 42.16,67.31 43.09,66.38 43.09,65.86 | 50.78,45.72 51.11,45.72 53.35,47.96 IC1.36 55.04,47.96 55.8,48.72 56.69,48.72 60.71,44.7 71.19,44.7 | SJ4.2 49.53,55.63 v47.75,53.85 | v44.2,64.26 43.01,64.26 42.51,64.77 | 57.84,62.66 57.84,61.9 v57.4,61.47 | v65.53,61.72 66.8,61.72 66.94,61.86
  Top 0.356: C20.1 66.94,61.86 66.55,61.47 66.55,58.42 66.8,58.17 75.69,58.17 76.96,59.44 76.96,63.5
  Top 0.406: C21.1 43.09,65.86 U5.21 50.8,65.86 | 50.8,65.86 50.88,65.86 52.44,67.42 U5.11 | 50.8,65.86 54,62.66 U5.3 57.84,62.66 64.01,68.83 65.53,68.83 66.44,67.93 R15.2 R14.2
  Top 0.457: U4.1 70.77,63.66 70.1,62.99 C17.1 C20.1 | U4.4 74.52,62.46 | 74.52,62.46 C18.A | C12.2 76.96,64.77 76.96,63.5 75.92,62.46 74.52,62.46
  Top 0.508: C7.+ 59.25,12.63 50.55,21.34 U3.2 | C8.1 44.89,15.17 46.74,17.02 46.74,20.07 48.01,21.34 U3.2 | J1.2 J1.1 51.6,32.73 49.53,34.8 46.74,34.8 45.72,33.78 45.72,23.37 47.75,21.34 U3.2 | JP6.1 83.06,65.02 82.8,64.77 76.96,64.77
  Top 0.61: U6.P$1 5.7,48.91 10.67,43.94 16.63,43.94 R20.1 | C23.1 17.04,43.52 R20.1 | R6.1 24.38,34.54 17.16,41.77 R20.1 | C21.1 42.51,64.77 C22.1
  Bottom 0.305: v47.75,53.85 44.2,57.4 v44.2,64.26 | v57.4,61.47 65.28,61.47 v65.53,61.72
5V  (via drill 0.5, 0.65)
  Top 0.254: U1.13 72.92,54.16 C15.1
  Top 0.305: SJ1.1 77.93,51.87 78.99,50.8 87.12,50.8 89.15,52.83 JP3.2
  Top 0.406: CN1.VBUS 67.64,4.24 63.75,8.13
  Top 0.457: v74.68,55.12 74.17,54.61 C15.1 | R12.2 v62.48,51.05 | R13.2 v62.48,47.5
  Top 0.61: U3.3 50.3,19.05 52.83,16.51 52.83,12 R2.2 51.24,6.55 F1.2 52.96,8.13 63.75,8.13 67.56,11.94 68.07,11.94 | R11.1 68.07,11.94 | 68.07,11.94 v65.79,14.22
  Bottom 0.457: JP4.2 80.77,61.21 v74.68,55.12 66.55,55.12 v62.48,51.05 v62.48,47.5
  Bottom 0.61: v65.79,14.22 76.71,25.15 86.11,25.15 88.65,27.69 JP8.2 89.15,27.69 87.63,29.21 87.63,34.8 88.9,36.07 JP1.2 88.39,36.07 87.38,37.08 87.38,43.18 88.39,44.2 JP2.2 89.15,44.2 87.38,45.97 87.38,51.56 88.65,52.83 JP3.2 88.39,52.83 87.38,53.85 87.38,60.2 88.39,61.21 JP4.2
12V
  Top 0.61: 27.75,7.87 C3.+ 18.17,7.87 D3.C 19.3,12.33 19.3,14.73 20.73,16.15 U2.1 | 27.75,7.87 R3.2 | C5.1 30.86,12.63 R5.2 29.97,11.75 29.97,9.4 28.45,7.87 27.75,7.87
ADO
  Top 0.254: SJ1.2 76.43,51.05 76.05,50.67 76.05,50.65 75.43,50.03 U1.9
BOOT0  (via drill 0.35)
  Top 0.305: R7.1 48.51,32.85 v48.51,33.27 | IC1.44 49.29,52.31 v49.28,52.32
  Bottom 0.305: v48.51,33.27 48.51,51.56 v49.28,52.32
BOOT1  (via drill 0.35)
  Top 0.305: R8.2 53.59,38.19 v53.59,38.61 | IC1.20 50.8,40.96 v50.8,39.37
  Bottom 0.305: v53.59,38.61 51.56,38.61 v50.8,39.37
CLKIN
  Top 0.254: U1.1 70.37,46.98 70.61,46.74 76.45,46.74 SJ2.2
DIO0
  Top 0.305: U7.6P 71.17,42.12 70.61,42.67 60.45,42.67 57.66,45.47 IC1.31
FIX
  Top 0.508: U6.P$5 11.7,51.3 LED2.A
FSYNC
  Top 0.254: U1.11 74.44,51.07 74.68,51.31 74.68,53.09 75.69,54.1 SJ3.2
GND  (via drill 0.35, 0.45, 0.65)
  Top 0.254: U1.18 70.37,54.2 C15.2 70.27,55.12 C14.2 | C16.2 81.11,48.6 80.26,47.75 78.49,47.75 77.98,48.26 SJ2.1 | C13.2 81.11,53.51 79.5,55.12 SJ3.1
  Top 0.305: U7.2P 79.17,41.74 77.98,42.93 74.93,42.93 73.09,44.77 C26.2 | C19.2 C17.2 C20.2 | C19.2 72.63,59.56 C18.C | C19.2 72.64,61.58 72.64,63.25 73.27,63.87 U4.3 73.27,65.65 73.66,66.04 76.37,66.04 C12.1 | IC1.8 47.26,44.46 v47.5,44.7 | v38.86,39.12 38.55,38.8 S1.3 | IC1.47 47.79,51.02 46.74,52.07 44.45,52.07 40.81,55.71 40.81,61.3 41.91,60.2 v41.91,58.42 | IC1.35 55.59,47.46 v56.13,48.01 | C13.2 83.91,55.37 JP3.3 88.9,53.59 v84.84,53.59 | C16.2 v83.31,49.28 | 89.92,14.57 X3.GND@3 | X3.GND@4 89.92,18.96
  Top 0.406: R4.1 Q1.2 | C5.2 26.35,10.73 25.52,11.57 D1.A | C22.2 40.81,61.3 41.4,60.71 43.18,60.71 45.14,62.66 U5.25 46.56,62.66 47.64,61.58 U5.29 | CN1.ID CN1.GND 83.49,7.44 81.53,9.4 v81.53,10.41
  Top 0.508: J1.6 J1.5 | C2.1 30.39,41.15 C11.1
  Top 0.61: D1.A 24.13,14.09 U2.3 | C23.2 16.2,49.85 U6.P$8 | U6.P$3 8.7,48.96 10.5,47.16 R18.1 11.43,47.11 v11.43,45.47 | C9.1 C10.1 | C21.2 C22.2 | X2.3 X2.4 | 90.17,14.22 X3.GND@3
  Bottom 0.305: v38.86,39.12 40.13,37.85 44.2,37.85 47.5,41.15 v47.5,44.7 41.91,50.29 v41.91,58.42 42.67,57.66 42.67,55.12 44.7,53.09 50.29,53.09 50.8,52.58 50.8,51.05 52.58,49.28 54.86,49.28 v56.13,48.01 | v83.31,49.28 83.31,52.32 84.58,53.59 v84.84,53.59
  Bottom 0.406: X3.GND@3 84.07,14.22 81.53,11.68 v81.53,10.41
  Bottom 0.61: D2.2 11.09,9.99 X2.3 | v11.43,45.47 11.43,43.69 6.35,38.61 X4.GND@3 2.03,38.61 1.02,37.59 1.02,34.04 1.52,33.53 X4.GND@4 | X3.GND@3 91.95,14.22 92.46,14.73 92.46,18.29 91.44,19.3 X3.GND@4
  pour Top: 0.25,71.12 0.25,0 93.73,0 93.73,11.43 93.47,11.43 93.47,71.12
GND_2
  pour Bottom: 0,71.12 0,41.91 0.25,41.66 0.25,24.13 0,24.13 0,0 93.73,0 93.73,11.43 93.22,11.43 93.22,23.11 93.47,23.37 93.47,71.37 0.25,71.37
MISO
  Top 0.305: U7.10P 69.17,30.15 55.85,43.46 IC1.27
MOSI
  Top 0.305: U7.11P 71.17,29.3 56.51,43.96 IC1.28
MOTOR1  (via drill 0.35)
  Top 0.305: JP1.1 86.87,33.53 v86.36,34.04 | IC1.16 48.79,37.83 v49.53,37.08
  Bottom 0.305: v86.36,34.04 83.57,36.83 49.78,36.83 v49.53,37.08
MOTOR2  (via drill 0.35)
  Top 0.305: JP2.1 85.85,41.66 v84.84,40.64 | IC1.17 49.29,38.6 v49.53,38.35
  Bottom 0.305: v84.84,40.64 81.79,37.59 50.29,37.59 v49.53,38.35
MOTOR3  (via drill 0.35)
  Top 0.305: JP3.1 86.87,50.29 82.8,46.23 68.33,46.23 67.56,45.47 61.21,45.47 v60.71,45.97 | IC1.18 49.79,42.16 49.28,42.67 v49.28,43.18
  Bottom 0.305: v60.71,45.97 51.56,45.97 49.28,43.69 v49.28,43.18
MOTOR4  (via drill 0.35)
  Top 0.305: JP4.1 82.55,58.67 v80.26,56.39 | v50.29,42.93 v50.29,42.92 IC1.19
  Bottom 0.305: v80.26,56.39 63.75,39.88 53.34,39.88 v50.29,42.93
N$1
  Top 0.508: J1.3 51.51,30.14 R7.2
N$2
  Top 0.305: IC1.5 37.25,45.96 X1.2
  Top 0.61: R1.2 29.89,45.55 C1.2 33.29,45.89 X1.2
N$3
  Top 0.305: IC1.6 37.74,45.46 35.29,43.01
  Top 0.61: R1.1 29.39,43.85 C2.2 35.29,43.01 X1.1
N$4
  Top 0.61: D1.C 22.43,13.91 U2.2 22.43,19.89 24.13,21.59 34.54,21.59 38.61,25.65 L1.1
N$5
  Top 0.356: LED1.A 49.34,14.25 R2.1
N$6
  Top 0.61: ZENER.1 34.8,3.3 33.34,4.77 R4.2 Q1.1
N$7
  Top 0.61: F1.1 48.98,3.68 C4.+ 46.31,7.21 C6.1 39.81,17.93 L1.2 37.42,20.32 26.67,20.32 25.83,19.48 U2.4
N$8
  Top 0.61: ZENER.2 27.94,3.05 R3.1
N$9
  Top 0.61: X2.1 X2.2 15.61,14.73 D3.A
  Bottom 0.61: D2.1 11.09,14.39 X2.2
N$10
  Top 0.508: R8.1 56.19,30.14 J1.4
N$11
  Top 0.254: U1.20 69.07,51.07 66.55,53.59 65.02,53.59 64.43,54.19 64.43,54.86 C14.1
N$12
  Top 0.406: R9.1 72.64,15.24 82.04,5.84 CN1.D+
N$13
  Top 0.406: R10.1 77.72,8.64 81.32,5.04 CN1.D-
N$14
  Top 0.254: C13.1 78.91,53.09 76.2,53.09 75.18,52.07 75.18,51.05 74.7,50.57 U1.10
N$15
  Top 0.356: U4.2 72.02,62.25 C19.1
N$16
  Top 0.406: U5.22 48.98,65.06 52.44,61.61 U5.35
N$17
  Top 0.406: SJ4.3 49.07,56.44 47.41,54.78 R16.2
N$18
  Top 0.305: R17.2 50.33,54.78 SJ4.1
N$19
  Top 0.508: LED2.C 11.84,49.06 R18.2
N$20
  Top 0.61: U6.P$11 19.2,65.42 18.29,64.52 5.33,64.52 3.05,62.23 3.05,45.21 5.59,42.67 9.14,42.67 9.14,36.83 8.38,36.07 X4.P JP5.1
N$21
  Top 0.508: X3.P 77.98,16.76 77.47,17.27 77.47,20.07 78.74,21.34 81.79,21.34 84.58,24.13 84.58,37.2 U7.1P
  Top 0.61: X3.P JP7.1
N$22
  Top 0.61: U6.P$19 7.2,66.97 8.13,66.04 16,66.04 17.7,67.73 U6.P$12
N$23  (via drill 0.55)
  other vias: 3.56,30.48
N$24  (via drill 0.55)
  other vias: 6.1,30.99
N$25  (via drill 0.55)
  other vias: 7.62,32
N$26  (via drill 0.55)
  other vias: 9.4,33.02
N$27  (via drill 0.55)
  other vias: 10.67,34.8
N$28  (via drill 0.55)
  other vias: 10.92,37.34
N$29  (via drill 0.55)
  other vias: 10.92,39.88
N$30  (via drill 0.55)
  other vias: 4.42,41.35
N$31  (via drill 0.55)
  other vias: 6.35,40.89
N$32  (via drill 0.55)
  other vias: 2.97,42.06
N$33  (via drill 0.55)
  other vias: 1.93,43.21
N$34  (via drill 0.55)
  other vias: 1.17,44.45
N$35  (via drill 0.55)
  other vias: 2.03,27.69
N$36  (via drill 0.55)
  other vias: 3.56,27.94
N$37  (via drill 0.55)
  other vias: 1.78,29.46
N$38  (via drill 0.55)
  other vias: 5.59,28.45
N$39  (via drill 0.55)
  other vias: 7.37,29.21
N$40  (via drill 0.55)
  other vias: 8.89,30.23
N$41  (via drill 0.55)
  other vias: 10.67,31.5
N$42  (via drill 0.55)
  other vias: 11.94,33.53
N$43  (via drill 0.55)
  other vias: 13.21,35.56
N$44  (via drill 0.55)
  other vias: 12.95,37.59
N$45  (via drill 0.55)
  other vias: 12.95,39.88
N$46  (via drill 0.55)
  other vias: 12.7,41.66
N$47  (via drill 0.55)
  other vias: 7.11,34.29
N$48  (via drill 0.55)
  other vias: 7.62,37.85
N$49  (via drill 0.55)
  other vias: 3.05,40.39
N$50  (via drill 0.55)
  other vias: 5.08,40.13
N$51  (via drill 0.55)
  other vias: 90.68,21.34
N$52  (via drill 0.55)
  other vias: 88.9,21.34
N$53  (via drill 0.55)
  other vias: 86.87,21.34
N$54  (via drill 0.55)
  other vias: 85.6,20.57
N$55  (via drill 0.55)
  other vias: 84.84,19.3
N$56  (via drill 0.55)
  other vias: 84.58,18.03
N$57  (via drill 0.55)
  other vias: 84.33,15.49
N$58  (via drill 0.55)
  other vias: 84.84,13.21
N$59  (via drill 0.55)
  other vias: 85.85,12.45
N$60  (via drill 0.55)
  other vias: 87.38,12.19
N$61  (via drill 0.55)
  other vias: 89.15,12.19
N$62  (via drill 0.55)
  other vias: 90.68,12.19
N$63  (via drill 0.55)
  other vias: 89.92,22.35
N$64  (via drill 0.55)
  other vias: 87.88,22.35
N$65  (via drill 0.55)
  other vias: 85.6,21.84
N$66  (via drill 0.55)
  other vias: 84.33,20.57
N$67  (via drill 0.55)
  other vias: 83.31,18.8
N$68  (via drill 0.55)
  other vias: 82.8,15.49
N$69  (via drill 0.55)
  other vias: 84.58,11.94
N$70  (via drill 0.55)
  other vias: 88.14,10.92
NRST
  Top 0.356: IC1.7 40.14,44.96 38.35,43.18 38.35,40.64 36.83,39.12 33.02,39.12 32.09,38.19 C11.2
  Top 0.61: C11.2 32.09,34.67 R6.2 32.45,34.32 S1.1 S1.4
NSS
  Top 0.305: U7.13P 75.17,22.34 74.17,21.34 66.8,21.34 65.02,23.11 65.02,32.37 54.94,42.46 IC1.25
ON/OFF
  Top 0.457: Q1.3 32.38,14.1
  Top 0.508: R5.1 31.82,14.67 32.38,14.1
  Top 0.61: U2.5 30.75,14.67 R5.1
PA11  (via drill 0.35)
  Top 0.305: R9.2 69.76,18.71 71.88,20.83 76.96,20.83 78.49,22.35 81.79,22.35 83.31,23.88 83.31,25.91 70.87,38.35 65.53,38.35 v62.74,41.15 | IC1.32 58.43,45.96 v60.96,43.43
  Bottom 0.305: v62.74,41.15 62.74,41.66 v60.96,43.43
PA12
  Top 0.305: R11.2 69.94,13.46 69.09,13.46 62.74,19.81 62.74,32.66 53.3,42.11 53.3,42.09 52.83,42.56 52.83,46.23 53.07,46.46 IC1.33
  Top 0.61: R10.2 69.76,9.31 71.46,11.01 R11.2
PC14  (via drill 0.35)
  Top 0.305: IC1.3 41.94,46.96 v38.61,50.29
  Top 0.406: C9.2 31.28,51.56 v33.02,51.56
  Top 0.61: Q2.4 C9.2
  Bottom 0.305: v38.61,50.29 37.59,51.31 33.27,51.31 v33.02,51.56
PC15
  Top 0.305: IC1.4 41.42,46.46 37.67,50.22 Q2.1
  Top 0.61: C10.2 30.9,58.76 35.05,54.61 36.32,54.61 37.67,53.26 Q2.1
PPM  (via drill 0.35)
  Top 0.305: JP8.1 88.39,25.15 v86.11,27.43 | IC1.22 51.79,35.84 v51.82,35.81
  Bottom 0.305: v86.11,27.43 77.72,35.81 v51.82,35.81
RESET_SPI
  Top 0.305: U7.14P 77.17,24.94 57.65,44.46 IC1.29
RX  (via drill 0.35)
  Top 0.305: D4.C 24.64,47.75 v25.15,47.24 | v43.69,39.88 46.95,39.88 47.29,40.21 IC1.13
  Bottom 0.305: v25.15,47.24 32.51,39.88 v43.69,39.88
RX_3V
  Top 0.61: U6.P$10 19.2,47.86 D4.A 19.3,43.65 R20.2
SCK
  Top 0.305: U7.12P 73.17,22.88 72.39,22.1 67.31,22.1 65.79,23.62 65.79,32.51 55.34,42.96 IC1.26
SCL  (via drill 0.35)
  Top 0.254: U1.23 67.91,49.53 R12.1
  Top 0.305: R16.1 45.05,56.48 44.2,55.63 44.2,53.59 44.96,52.83 47.5,52.83 48.79,51.54 IC1.45
  Top 0.356: R14.1 65.14,63.9 65.53,63.5 67.31,63.5 68.07,64.26 68.07,66.04 69.27,67.24 U4.8 70.77,67.92 70.36,68.33 v69.6,68.33 | U5.32 50.04,61.21 v49.53,61.72 | R12.1 66.38,51.98 65.79,52.58 58.67,52.58 v57.15,54.1
  Top 0.406: U5.32 50.04,58.93 49.28,58.17 47.92,58.17 R16.1
  Bottom 0.356: v69.6,68.33 56.13,68.33 v49.53,61.72 v57.15,54.1
SDA
  Top 0.254: U1.24 68.67,49.02 67.14,47.5 R13.1 | IC1.46 48.29,48.49 49.25,47.52 52.25,47.52 56.39,51.66
  Top 0.305: R17.1 55.54,56.48 56.39,55.63 56.39,51.66 56.39,51.56
  Top 0.356: U4.7 72.02,66.69 71.37,66.04 69.85,66.04 69.34,65.53 69.34,64.52 67.56,62.74 65.02,62.74 63.5,64.26 | R15.1 64.26,67.06 63.5,66.29 63.5,64.26 | R17.1 61.89,64.26 63.5,64.26 | R13.1 66.38,48.68 65.79,49.28 58.67,49.28 56.39,51.56
  Top 0.406: R17.1 54.1,57.66 53.24,58.52 U5.36
SWCLK  (via drill 0.35)
  Top 0.305: JP6.3 88.14,66.29 78.49,56.64 62.99,56.64 v61.98,55.63 | IC1.37 52.79,51.26 v52.83,51.31
  Bottom 0.305: v61.98,55.63 59.94,55.63 55.63,51.31 v52.83,51.31
SWDIO  (via drill 0.35)
  Top 0.305: JP6.2 85.6,65.02 77.98,57.4 62.74,57.4 v58.93,53.59 | IC1.34 54.3,46.99 v56.39,46.99
  Bottom 0.305: v58.93,53.59 58.93,49.53 v56.39,46.99
TX  (via drill 0.35)
  Top 0.305: U6.P$9 17.7,54.53 v18.54,55.37 | IC1.12 44.24,42.46 v43.43,41.66
  Bottom 0.305: v18.54,55.37 32.26,41.66 v43.43,41.66
VIO
  Top 0.254: U1.8 75.44,49.53 75.69,49.28 C16.1

### Text on the board
tNames: 3.3V | SWDIO | SWCLK | GND | HMC6343A | MPLC3115A | DESINGER | ENES GÜRSOY | GND | 5V | GPS | ESC 4 | GND | MPU6050 | 5V | ESC 3 | GND | 5V | ESC 2 | GND | RFM69HCW | 5V | ESC 1 | GND | 5V | POWER | PPM | + | + | - | USB | -